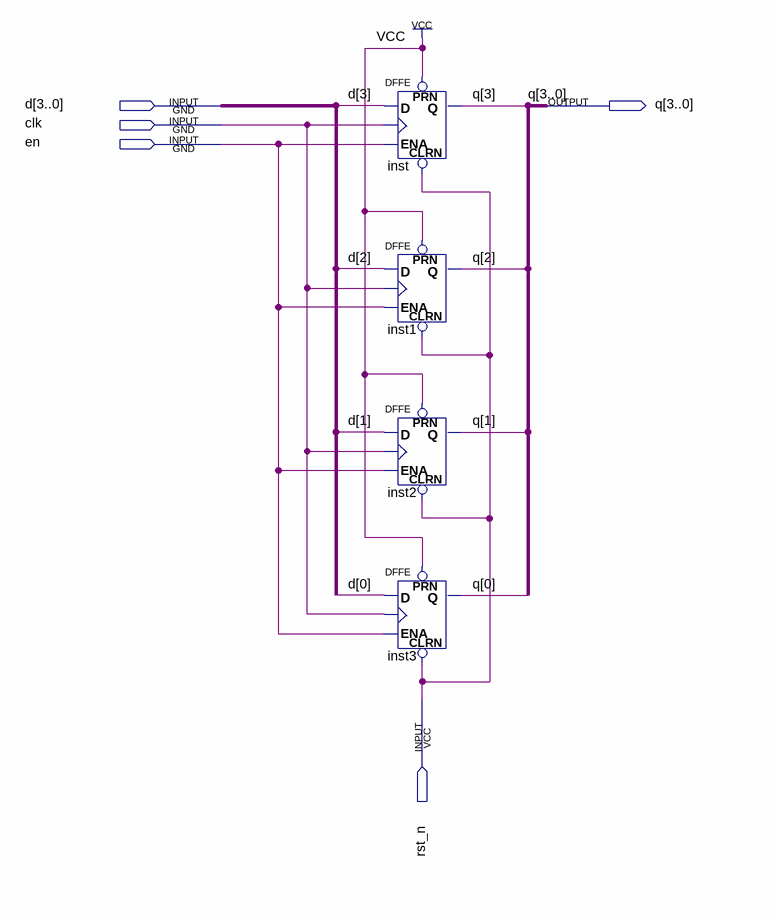
[diagram p0: schematic sheet]
// Quartus schematic dffe4.bdf as structural Verilog: 4 symbols, 5 pins
module dffe4 (
  input  [3:0] d,
  input  clk,
  input  en,
  input  rst_n,
  output [3:0] q
);

  DFFE inst (.PRN(1'b1), .CLRN(rst_n), .D(d[3]), .CLK(clk), .ENA(en), .Q(q[3]));
  DFFE inst1 (.PRN(1'b1), .CLRN(rst_n), .D(d[2]), .CLK(clk), .ENA(en), .Q(q[2]));
  DFFE inst2 (.PRN(1'b1), .CLRN(rst_n), .D(d[1]), .CLK(clk), .ENA(en), .Q(q[1]));
  DFFE inst3 (.PRN(1'b1), .CLRN(rst_n), .D(d[0]), .CLK(clk), .ENA(en), .Q(q[0]));
endmodule
